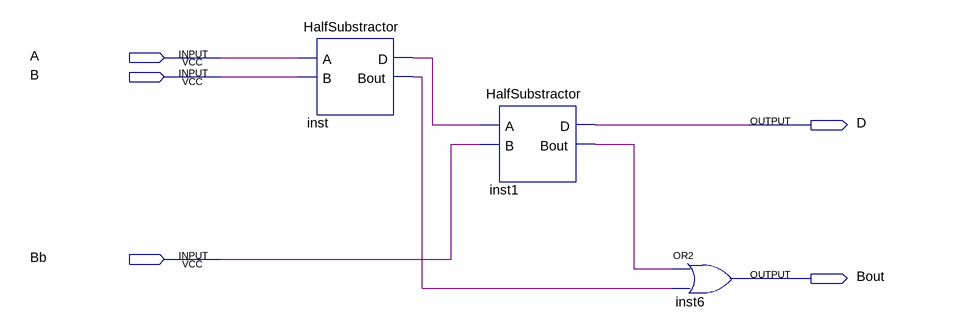
[diagram p0: schematic sheet]
// Quartus schematic FullSubtractor.bdf as structural Verilog: 3 symbols, 5 pins
module FullSubtractor (
  input  A,
  input  B,
  input  Bb,
  output D,
  output Bout
);

  wire inst1_bout, inst_bout, inst_d;

  HalfSubstractor inst (.A(A), .B(B), .D(inst_d), .Bout(inst_bout));
  HalfSubstractor inst1 (.A(inst_d), .B(Bb), .D(D), .Bout(inst1_bout));
  or inst6 (Bout, inst1_bout, inst_bout);
endmodule
